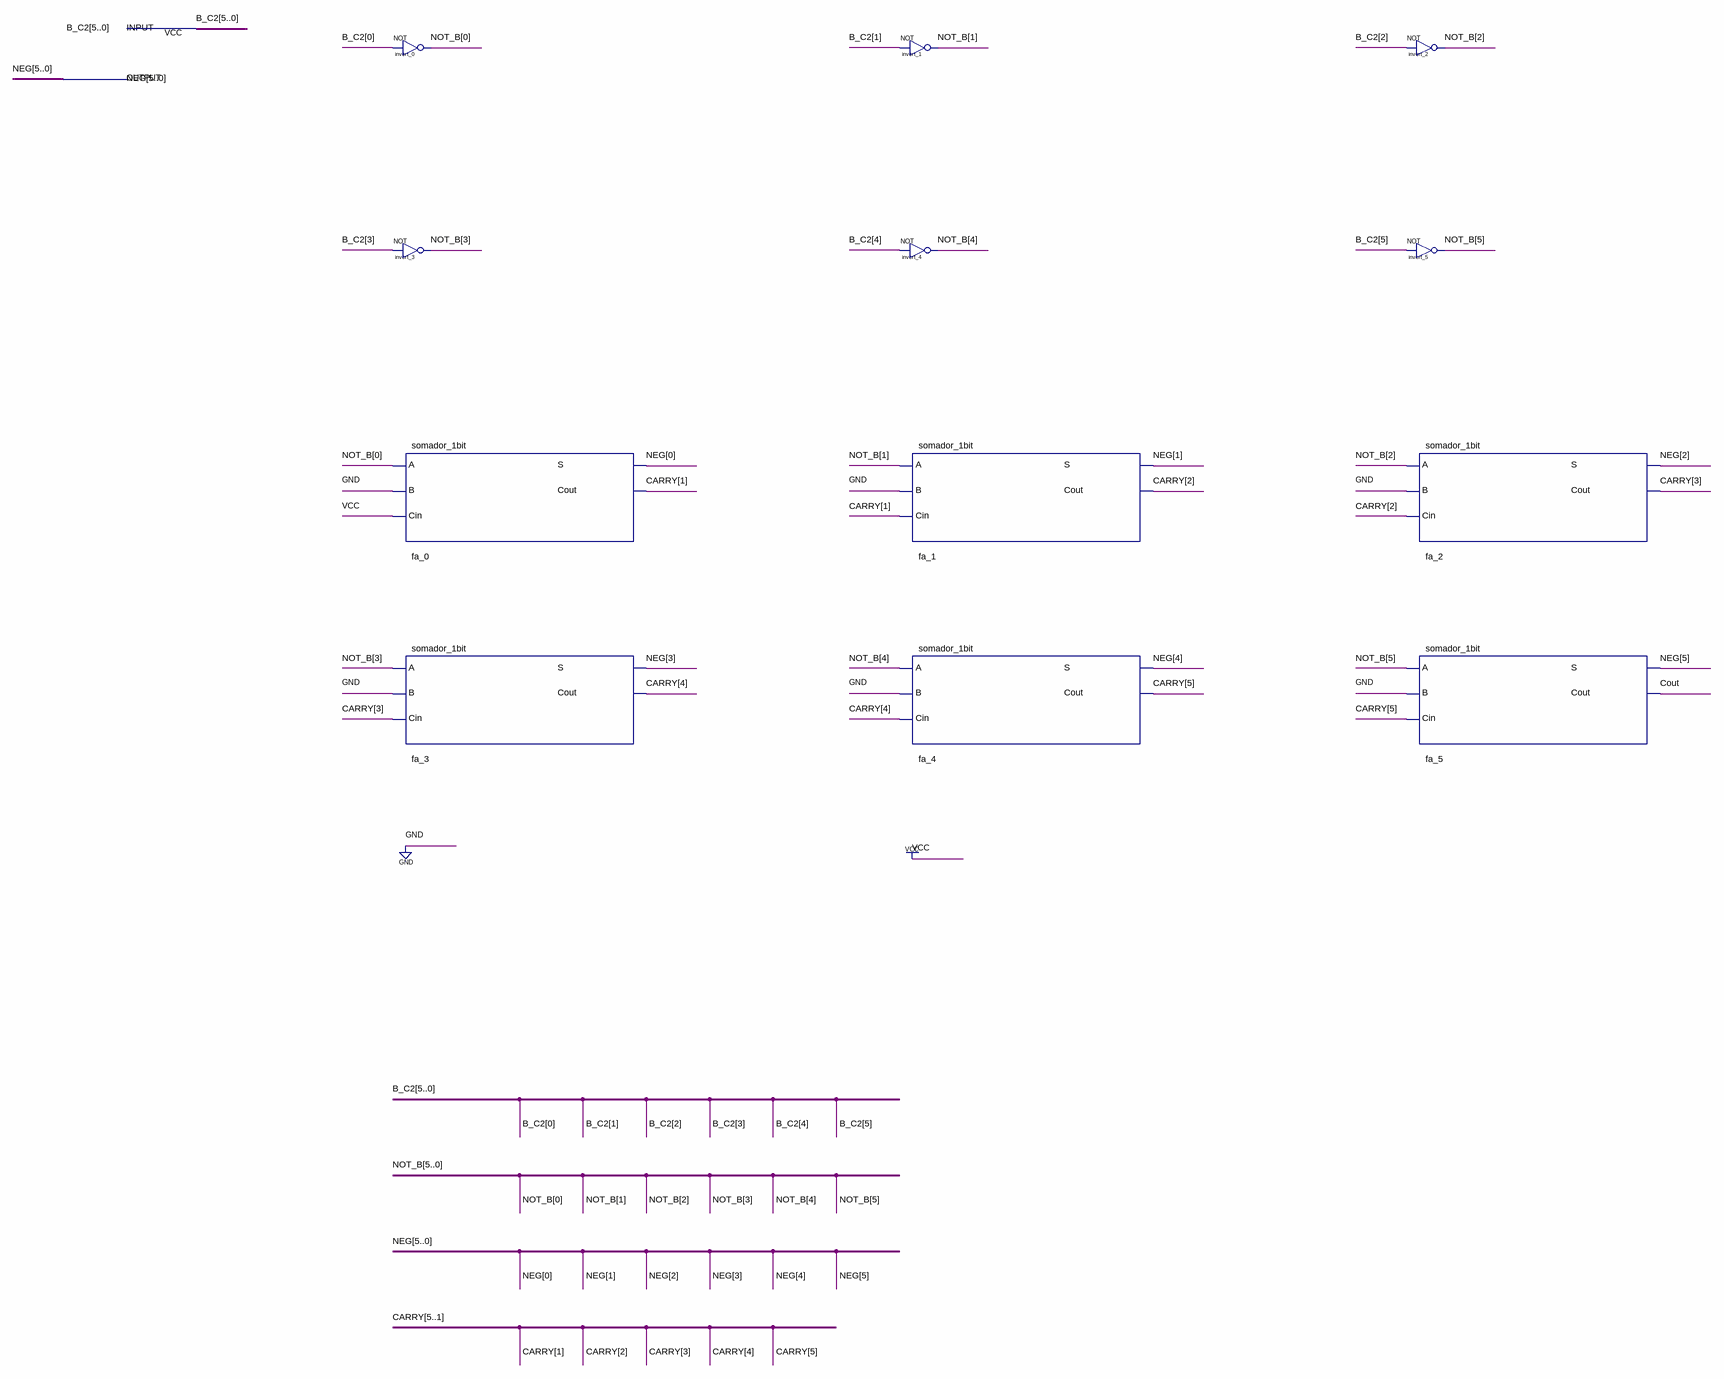
[diagram p0: schematic sheet]
// Quartus schematic negador_c2_6bit.bdf as structural Verilog: 12 symbols, 2 pins
module negador_c2_6bit (
  input  [5:0] B_C2,
  output [5:0] NEG
);

  wire Cout;
  wire [5:0] NOT_B;
  wire [5:1] CARRY;

  not invert_0 (NOT_B[0], B_C2[0]);
  not invert_3 (NOT_B[3], B_C2[3]);
  somador_1bit fa_0 (.A(NOT_B[0]), .B(1'b0), .Cin(1'b1), .S(NEG[0]), .Cout(CARRY[1]));
  somador_1bit fa_3 (.A(NOT_B[3]), .B(1'b0), .Cin(CARRY[3]), .S(NEG[3]), .Cout(CARRY[4]));
  not invert_1 (NOT_B[1], B_C2[1]);
  not invert_4 (NOT_B[4], B_C2[4]);
  somador_1bit fa_1 (.A(NOT_B[1]), .B(1'b0), .Cin(CARRY[1]), .S(NEG[1]), .Cout(CARRY[2]));
  somador_1bit fa_4 (.A(NOT_B[4]), .B(1'b0), .Cin(CARRY[4]), .S(NEG[4]), .Cout(CARRY[5]));
  not invert_2 (NOT_B[2], B_C2[2]);
  not invert_5 (NOT_B[5], B_C2[5]);
  somador_1bit fa_2 (.A(NOT_B[2]), .B(1'b0), .Cin(CARRY[2]), .S(NEG[2]), .Cout(CARRY[3]));
  somador_1bit fa_5 (.A(NOT_B[5]), .B(1'b0), .Cin(CARRY[5]), .S(NEG[5]), .Cout(Cout));
endmodule
